# EAGLE design AnlgInp (EAGLE 5.11)
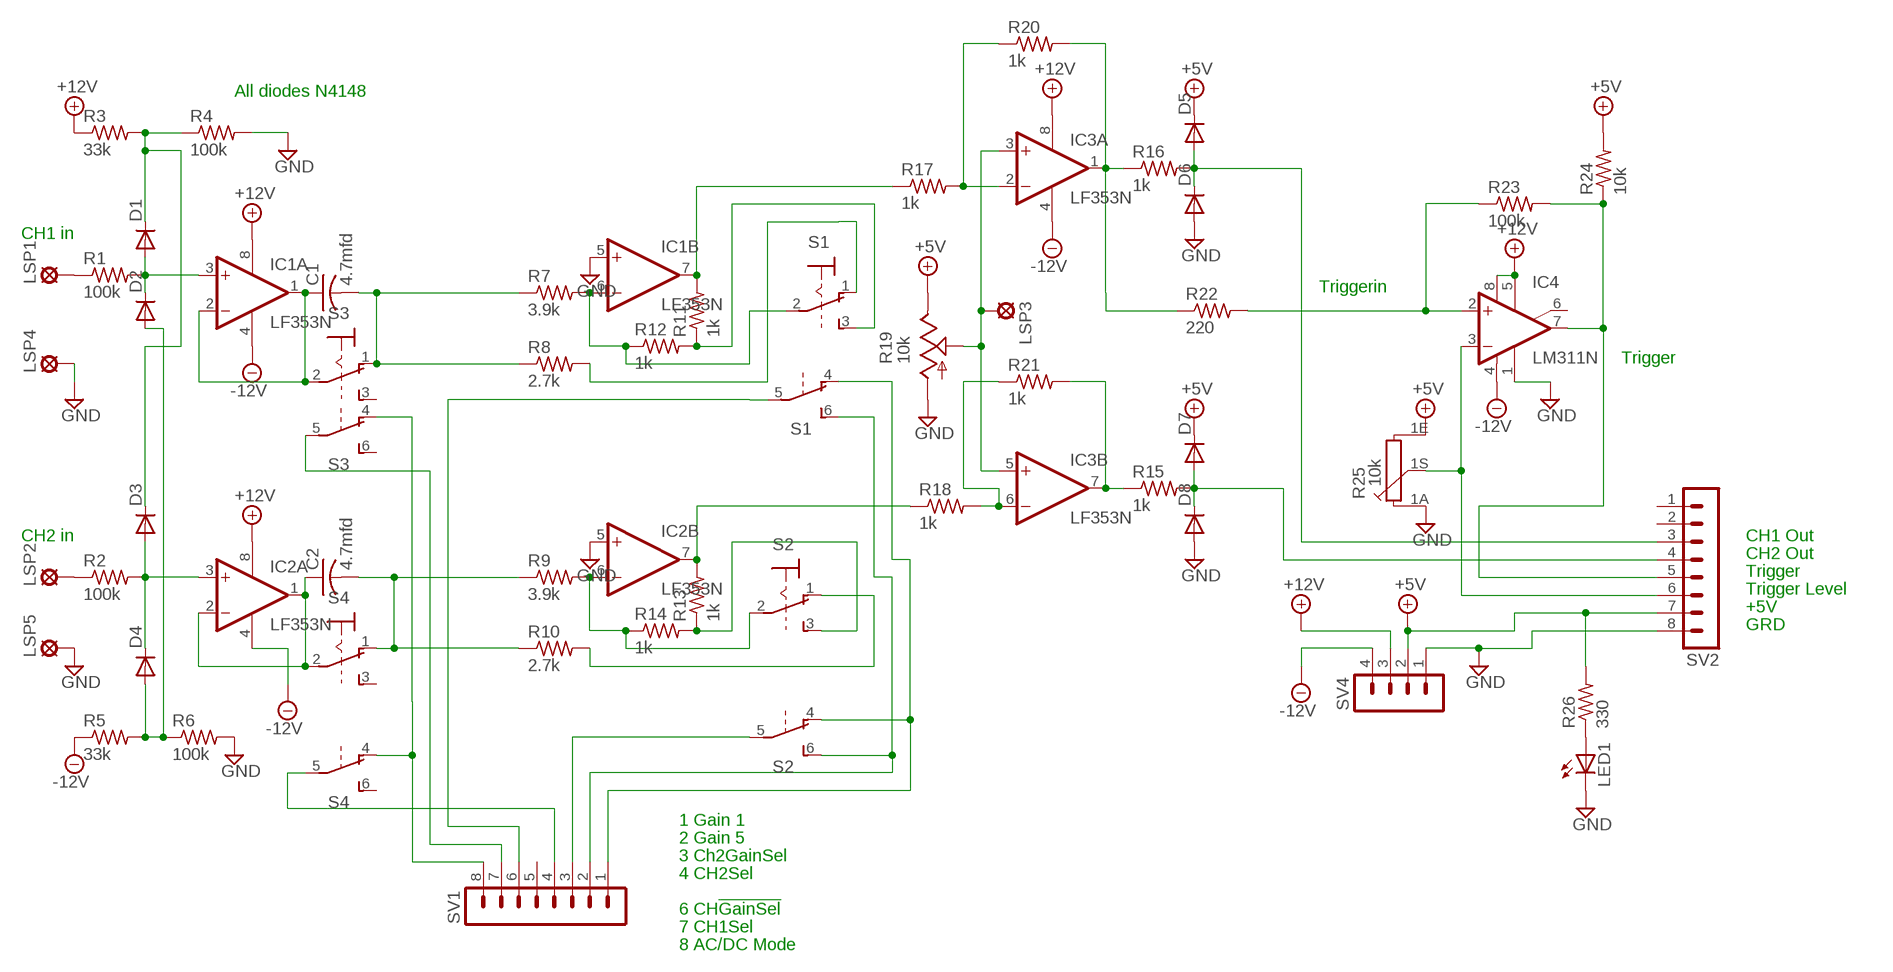
[diagram p0: schematic, sheet 1]

## Parts
C1  4.7mfd  C-US025-025X050  [C025-025X050]
C2  4.7mfd  C-US025-025X050  [C025-025X050]
D1  1N4148DO35-7  [DO35-7]
D2  1N4148DO35-7  [DO35-7]
D3  1N4148DO35-7  [DO35-7]
D4  1N4148DO35-7  [DO35-7]
D5  1N4148DO35-7  [DO35-7]
D6  1N4148DO35-7  [DO35-7]
D7  1N4148DO35-7  [DO35-7]
D8  1N4148DO35-7  [DO35-7]
IC1  LF353N  [DIL08]
IC2  LF353N  [DIL08]
IC3  LF353N  [DIL08]
IC4  LM311N  [DIL08]
LED1  LED3MM  [LED3MM]
LSP1  LSP11  [LSP11]
LSP2  LSP11  [LSP11]
LSP3  LSP11  [LSP11]
LSP4  LSP11  [LSP11]
LSP5  LSP11  [LSP11]
R1  100k  R-US_0204/7  [0204/7]
R2  100k  R-US_0204/7  [0204/7]
R3  33k  R-US_0204/7  [0204/7]
R4  100k  R-US_0204/7  [0204/7]
R5  33k  R-US_0204/7  [0204/7]
R6  100k  R-US_0204/7  [0204/7]
R7  3.9k  R-US_0204/7  [0204/7]
R8  2.7k  R-US_0204/7  [0204/7]
R9  3.9k  R-US_0204/7  [0204/7]
R10  2.7k  R-US_0204/7  [0204/7]
R11  1k  R-US_0204/7  [0204/7]
R12  1k  R-US_0204/7  [0204/7]
R13  1k  R-US_0204/7  [0204/7]
R14  1k  R-US_0204/7  [0204/7]
R15  1k  R-US_0204/7  [0204/7]
R16  1k  R-US_0204/7  [0204/7]
R17  1k  R-US_0204/7  [0204/7]
R18  1k  R-US_0204/7  [0204/7]
R19  10k  TRIM_US-B25P  [B25P]
R20  1k  R-US_0204/7  [0204/7]
R21  1k  R-US_0204/7  [0204/7]
R22  220  R-US_0204/7  [0204/7]
R23  100k  R-US_0204/7  [0204/7]
R24  10k  R-US_0204/7  [0204/7]
R25  10k  PC16S  [PC16S]
R26  330  R-US_0204/7  [0204/7]
S1  320-938  [320-938]
S2  320-938  [320-938]
S3  320-938  [320-938]
S4  320-938  [320-938]
SV1  MA08-1  [MA08-1]
SV2  MA08-1  [MA08-1]
SV4  MA04-1  [MA04-1]

## Nets
+5V: D5.C D7.C R19.E R24.2 R25.1E R26.2 SV2.7 SV4.2
+12V: IC1.8(P:V+) IC2.8(P:V+) IC3.8(P:V+) IC4.5(ON) IC4.8(V+) R3.1 SV4.3
-12V: IC1.4(P:V-) IC2.4(P:V-) IC3.4(P:V-) IC4.4(V-) R5.1 SV4.4
GND: D6.A D8.A IC1.5(B:+IN) IC2.5(B:+IN) IC4.1(GND) LED1.K(C) LSP4.MP LSP5.MP R4.2 R6.2 R19.A R25.1A SV2.8 SV4.1
N$1: D1.A D2.C IC1.3(A:+IN) R1.2
N$2: D1.C D3.C R3.2 R4.1
N$3: D2.A D4.A R5.2 R6.1
N$4: D3.A D4.C IC2.3(A:+IN) R2.2
N$5: S1.5(B:P) SV1.6
N$6: LSP1.MP R1.1
N$7: LSP2.MP R2.1
N$8: C1.1 IC1.1(A:OUT) IC1.2(A:-IN) S3.2(1:P)
N$9: C2.1 IC2.1(A:OUT) IC2.2(A:-IN) S4.2(1:P)
N$10: S3.4(B:O) S4.4(B:O) SV1.8
N$11: C1.2 R7.1 R8.1 S3.1(1:O)
N$12: C2.2 R9.1 R10.1 S4.1(1:O)
N$13: IC1.6(B:-IN) R7.2 R12.1 S1.2(1:P)
N$14: IC2.6(B:-IN) R9.2 R14.1 S2.2(1:P)
N$15: IC1.7(B:OUT) R11.2 R17.1
N$16: IC2.7(B:OUT) R13.2 R18.1
N$17: R11.1 R12.2 S1.3(1:S)
N$19: S4.5(B:P) SV1.4
N$20: R10.2 S2.1(1:O)
N$21: IC3.3(A:+IN) IC3.5(B:+IN) LSP3.MP R19.S
N$22: IC3.2(A:-IN) R17.2 R20.1
N$23: IC3.1(A:OUT) R16.1 R20.2 R22.1
N$24: IC3.7(B:OUT) R15.1 R21.2
N$25: IC3.6(B:-IN) R18.2 R21.1
N$26: LED1.A R26.1
N$27: S2.5(B:P) SV1.3
N$29: IC4.2(+IN) R22.2 R23.1
N$30: IC4.3(-IN) R25.1S SV2.6
N$31: IC4.7(OUT) R23.2 R24.1 SV2.5
N$32: S3.5(B:P) SV1.7
N$33: R8.2 S1.1(1:O)
N$34: R13.1 R14.2 S2.3(1:S)
N$35: S1.4(B:O) S2.4(B:O) SV1.1
N$36: S1.6(B:S) S2.6(B:S) SV1.2
N$39: D7.A D8.C R15.2 SV2.4
N$49: D5.A D6.C R16.2 SV2.3
Unconnected: IC4.6(ON/STR) S3.3(1:S) S3.6(B:S) S4.3(1:S) S4.6(B:S) SV1.5 SV2.1 SV2.2

## Notes on the sheet
- All diodes N4148
- CH1 in
- Triggerin
- Trigger
- CH2 in | CH1 Out
- CH2 Out
- Trigger
- Trigger Level
- +5V
- GRD
- 1 Gain 1
- 2 Gain 5
- 3 Ch2GainSel
- 4 CH2Sel
- 6 CH!GainSel
- 7 CH1Sel
- 8 AC/DC Mode

## Library data of the parts
C1 C2 = resistor:C-US: CAPACITOR, American symbol
D1-D8 = diode:1N4148: DIODE high speed (Philips)
IC1-IC3 = linear:LF353: OP AMP
IC4 = linear:LM311: COMPARATOR
LED1 = led:LED: LED OSRAM: - CHIPLED LG R971, LG N971, LY N971, LG Q971, LY Q971, LO R971, LY R971 LH N974, LH R974 LS Q976, LO Q976, LY Q976 LO Q996 - Hyper CHIPLED LW Q18S LB Q993, LB Q99A, LB R99A - SideLED LS A670, LO A670, LY A670, LG A670, LP A670 LB A673, LV A673, LT A673, LW A673 LH A674 LY A675 LS A676, LA A676, LO A676, LY A676, LW A676 LS A679, LY A679, LG A679 - Hyper Micro SIDELED® LS Y876, LA Y876, LO Y876, LY Y876 LT Y87S - SmartLED LW L88C, LW L88S LB L89C, LB L89S, LG L890 LS L89K, LO L89K, LY L89K LS L896, LA L896, LO L896, LY L896 - TOPLED LS T670, LO T670, LY T670, LG T670, LP T670 LSG T670, LSP T670, LSY T670, LOP T670, LYG T670 LG T671, LOG T671, LSG T671 LB T673, LV T673, LT T673, LW T673 LH T674 LS T676, LA T676, LO T676, LY T676, LB T676, LH T676, LSB T676, LW T676 LB T67C, LV T67C, LT T67C, LS T67K, LO T67K, LY T67K, LW E67C LS E67B, LA E67B, LO E67B, LY E67B, LB E67C, LV E67C, LT E67C LW T67C LS T679, LY T679, LG T679 LS T770, LO T770, LY T770, LG T770, LP T770 LB T773, LV T773, LT T773, LW T773 LH T774 LS E675, LA E675, LY E675, LS T675 LS T776, LA T776, LO T776, LY T776, LB T776 LHGB T686 LT T68C, LB T68C - Hyper Mini TOPLED® LB M676 - Mini TOPLED Santana® LG M470 LS M47K, LO M47K, LY M47K Source: http://www.osram.convergy.de LUXEON: - LUMILED® LXK2-PW12-R00, LXK2-PW12-S00, LXK2-PW14-U00, LXK2-PW14-V00 LXK2-PM12-R00, LXK2-PM12-S00, LXK2-PM14-U00 LXK2-PE12-Q00, LXK2-PE12-R00, LXK2-PE12-S00, LXK2-PE14-T00, LXK2-PE14-U00 LXK2-PB12-K00, LXK2-PB12-L00, LXK2-PB12-M00, LXK2-PB14-N00, LXK2-PB14-P00, LXK2-PB14-Q00 LXK2-PR12-L00, LXK2-PR12-M00, LXK2-PR14-Q00, LXK2-PR14-R00 LXK2-PD12-Q00, LXK2-PD12-R00, LXK2-PD12-S00 LXK2-PH12-R00, LXK2-PH12-S00 LXK2-PL12-P00, LXK2-PL12-Q00, LXK2-PL12-R00 Source: www.luxeon.com KINGBRIGHT: KA-3528ASYC Source: www.kingbright.com
LSP1-LSP5 = solpad:LSP11: SOLDER PAD drill 1.1 mm
R1-R6 = resistor:R-US_: RESISTOR, American symbol
R7-R18 R20-R24 R26 = rcl:R-US_: RESISTOR, American symbol
R19 = pot:TRIM_US-: POTENTIOMETER
R25 = piher:PC16S: POTENTIOMETER single carbon potentiometer, 16 mm, S3ROH; OC_FARNELL: 4452940; OC_NEWARK: unknown
S1-S4 = switch:320-938: TOGGLE SWITCH distributor RS Components
SV1 SV2 = con-lstb:MA08-1: PIN HEADER; OC_FARNELL: unknown; OC_NEWARK: unknown
SV4 = con-lstb:MA04-1: PIN HEADER; OC_FARNELL: unknown; OC_NEWARK: unknown

## Board
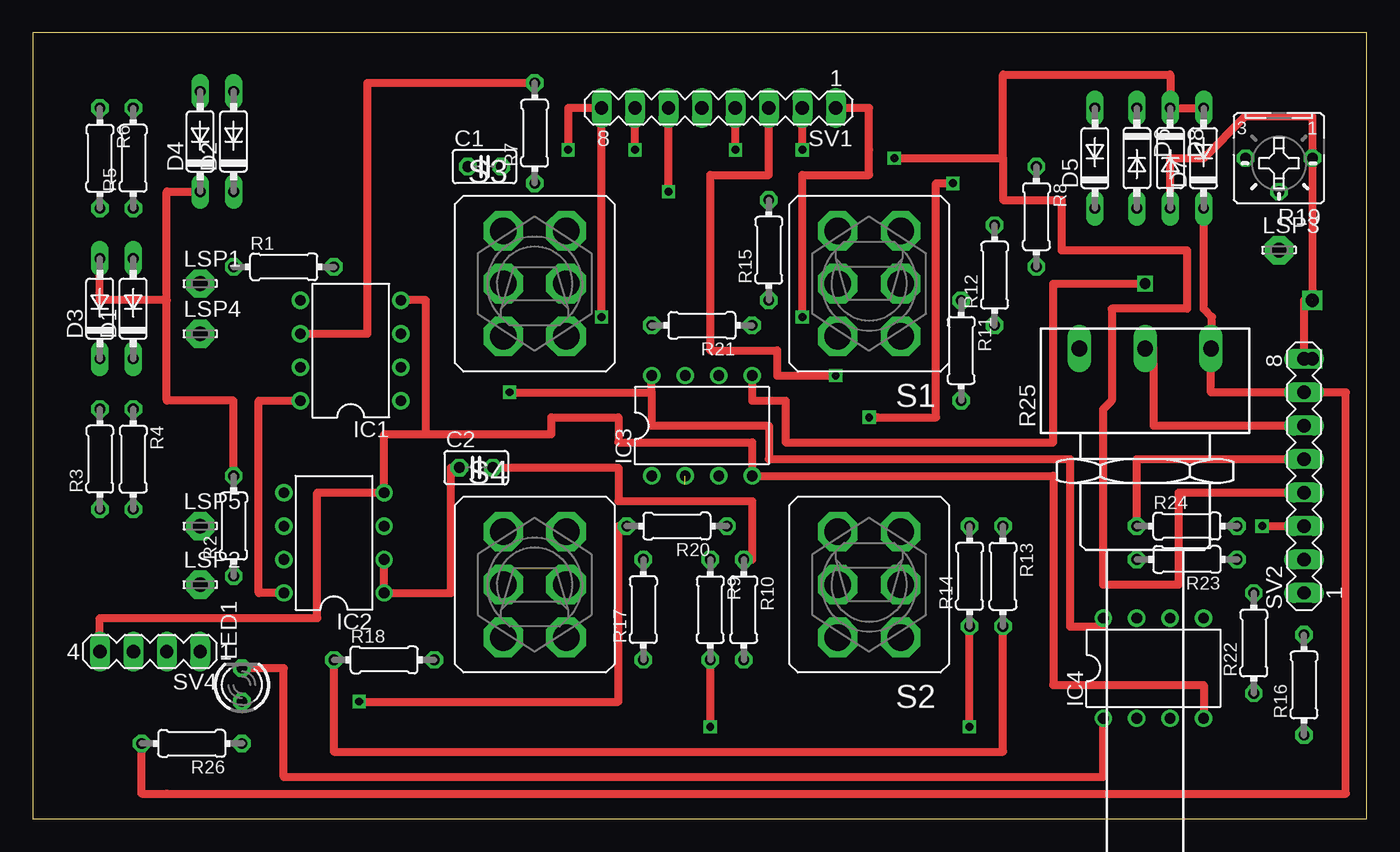
[diagram p1: board, top side]
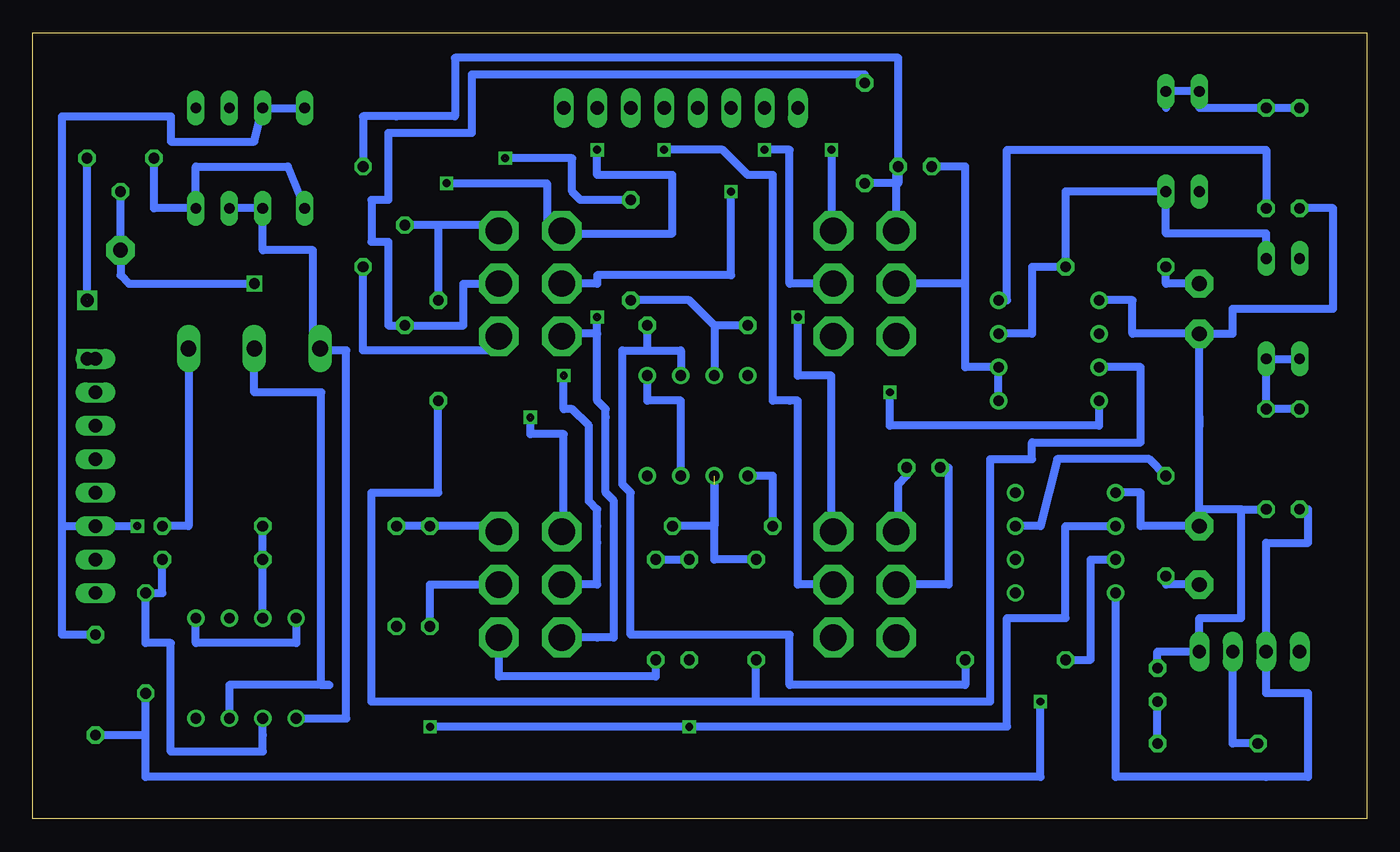
[diagram p2: board, bottom side, seen from below]

Size 101.27 x 59.68 mm. Coordinates in mm from the lower left corner, seen from the top.
Outline: 0,0 101.27,0 101.27,59.68 0,59.68 0,0
Copper layers (1*16): Top 0.035mm / dielectric 1.5mm / Bottom 0.035mm
Design rules "025mill": minimum track width 10mil, minimum drill 24mil, track to track 25mil, track to pad 25mil, pad to pad 25mil, via to via 25mil, smd to smd 25mil, copper to edge 25mil, drill to drill 8mil, minimum pad ring 10mil, minimum via ring 8mil, stop-mask expansion 4mil, vias tented up to drill 0mil, thermal gap 10mil

### Footprints (pad centres in the part's own frame; a part is rotated, then mirrored left to right if it is on the bottom)
C025-025X050 = drill 0.813 octagon: 1 -1.27,0; 2 1.27,0
DO35-7 = drill 0.813 long: A 3.81,0; C -3.81,0
DIL08 = drill 0.813 pad 1.27 round: 1 -3.81,-3.81; 2 -1.27,-3.81; 3 1.27,-3.81; 4 3.81,-3.81; 5 3.81,3.81; 6 1.27,3.81; 7 -1.27,3.81; 8 -3.81,3.81
LED3MM = drill 0.813 octagon: A -1.27,0; K 1.27,0
LSP11 = drill 1.118 pad 2.159 octagon: MP 0,0
0204/7 = drill 0.813 octagon: 1 -3.81,0; 2 3.81,0
B25P = drill 0.813 octagon: A -2.54,0; E 2.54,0; S 0,2.54
PC16S = drill 1.2 long: 1A -5,6.5; 1E 5,6.5; 1S 0,6.5
320-938 = drill 2.007 octagon: 1 -2.388,4.013; 2 -2.388,0; 3 -2.388,-4.013; 4 2.388,4.013; 5 2.388,0; 6 2.388,-4.013
MA08-1 = drill 1.016 long: 1 -8.89,0; 2 -6.35,0; 3 -3.81,0; 4 -1.27,0; 5 1.27,0; 6 3.81,0; 7 6.35,0; 8 8.89,0
MA04-1 = drill 1.016 long: 1 -3.81,0; 2 -1.27,0; 3 1.27,0; 4 3.81,0

### Placement (x,y rotation side)
C1  34.29,49.53 0 top
C2  33.66,26.67 0 top
D1  7.62,38.73 90 top
D2  15.24,51.44 90 top
D3  5.08,38.73 90 top
D4  12.7,51.44 90 top
D5  80.64,50.16 90 top
D6  83.82,50.16 270 top
D7  88.9,50.16 90 top
D8  86.36,50.16 270 top
IC1  24.13,35.56 90 top
IC2  22.86,20.95 90 top
IC3  50.8,29.84 0 top
IC4  85.09,11.43 0 top
LED1  15.88,10.16 90 top
LSP1  12.7,40.64 0 top
LSP2  12.7,17.78 0 top
LSP3  94.61,43.18 0 top
LSP4  12.7,36.83 0 top
LSP5  12.7,22.23 0 top
R1  19.05,41.91 0 top
R2  15.24,22.23 90 top
R3  5.08,27.3 90 top
R4  7.62,27.3 270 top
R5  7.62,50.16 90 top
R6  5.08,50.16 270 top
R7  38.1,52.07 90 top
R8  76.2,45.72 270 top
R9  51.44,15.88 270 top
R10  53.98,15.88 270 top
R11  70.48,35.56 270 top
R12  73.03,41.27 90 top
R13  73.66,18.41 270 top
R14  71.12,18.41 90 top
R15  55.88,43.18 90 top
R16  96.52,10.16 90 top
R17  46.35,15.88 90 top
R18  26.67,12.06 0 top
R19  94.61,50.16 180 top
R20  48.9,22.23 180 top
R21  50.8,37.47 180 top
R22  92.71,13.34 90 top
R23  87.63,19.68 180 top
R24  87.63,22.23 0 top
R25  84.45,29.21 0 top
R26  12.06,5.71 180 top
S1  63.5,40.64 180 top
S2  63.5,17.78 180 top
S3  38.1,40.64 0 top
S4  38.1,17.78 0 top
SV1  52.07,53.98 180 top
SV2  96.52,26.04 90 top
SV4  8.89,12.7 180 top

### Tracks (layer width: path | path; a pad name or v marks a point on that pad's centre or on a via)
+5V
  Top 0.61: R26.2 8.26,1.91 10.16,1.91 99.69,1.91 99.69,32.38 SV2.7 89.45,32.38 89.45,34.92 R25.1E 89.53,35.79 89.53,38.1 88.9,38.73 D7.C
  Bottom 0.61: R19.E 92.08,46.35 D7.C 88.9,49.53 81.92,49.53 D5.C | R24.2 89.45,22.23 R25.1E | SV4.2 10.16,5.71 R26.2
+12V  (via drill 0.6)
  Top 0.61: 46.99,32.38 46.99,29.84 55.88,29.84 55.88,27.3 78.74,27.3 78.74,14.61 81.28,14.61 IC4.8 | 46.99,32.38 IC3.8 | IC1.8 17.14,31.75 17.14,17.14 IC2.8 | v36.2,32.38 46.99,32.38
  Bottom 0.61: IC4.5 88.9,13.34 81.28,13.34 IC4.8 | IC2.8 19.05,3.17 7.62,3.17 4.45,3.17 4.45,9.53 7.62,9.53 SV4.3 7.62,20.95 4.45,20.95 4.45,23.5 R3.1 | IC1.8 20.32,29.84 36.2,29.84 v36.2,32.38
-12V
  Top 0.61: 29.84,29.21 28.57,29.21 26.67,29.21 IC2.4 21.59,24.77 21.59,15.24 5.08,15.24 SV4.4 | 29.84,29.21 39.37,29.21 39.37,30.48 44.45,30.48 44.45,28.57 54.61,28.57 | 54.61,28.57 IC3.4 | IC4.4 88.9,10.16 77.47,10.16 77.47,26.04 IC3.4 | IC1.4 29.84,39.37 29.84,29.21 | 54.61,28.57 IC3.4
  Bottom 0.61: IC1.4 27.3,39.37 27.3,50.8 7.62,50.8 R5.1
GND  (via drill 1)  (1 unrouted)
  Top 0.61: IC4.1 81.28,3.17 26.04,3.17 19.05,3.17 19.05,11.43 LED1.K | v97.16,34.92 SV2.8 96.52,39.37 97.16,39.37 97.16,45.72 97.16,53.34 92.08,53.34 88.9,50.16 86.36,50.16 D8.A
  Bottom 0.61: D8.A D6.A 83.82,43.18 80.01,43.18 80.01,35.71 R25.1A 79.45,35.56 77.47,35.56 77.47,7.62 IC4.1 | SV2.8 v97.16,34.92 | LSP4.MP 17.78,36.83 17.78,39.37 IC1.5 | 12.7,30.48 12.7,29.84 | 12.7,30.48 LSP4.MP | 12.7,22.86 LSP5.MP 17.14,22.23 17.14,24.77 IC2.5 | 12.7,22.86 12.7,30.48 | 9.53,23.5 R4.2 | 9.53,23.5 12.7,23.5 12.7,22.86 | LSP4.MP 10.16,36.83 10.16,38.73 2.54,38.73 2.54,46.35 R6.2 | 9.53,23.5 9.53,15.24 12.7,15.24 SV4.1 15.88,12.7 LED1.K | 97.16,39.37 R19.A
N$1
  Bottom 0.61: IC1.3 25.4,36.83 25.4,41.91 R1.2 22.86,47.62 D2.C 15.24,44.45 7.62,44.45 D1.A
N$2
  Bottom 0.61: D3.C D1.C R4.1 R3.2
N$3
  Bottom 0.61: R6.1 R5.2 12.7,53.98 D4.A D2.A | D2.A 15.24,53.98 D2.A
N$4
  Top 0.61: R2.2 15.24,31.75 10.16,31.75 10.16,39.37 | 10.16,39.37 5.08,39.37 D3.A | D4.C 10.16,47.62 10.16,39.37
  Bottom 0.61: IC2.3 24.77,22.23 23.5,27.3 16.51,27.3 R2.2
N$5  (via drill 0.6)
  Top 0.61: v48.26,47.62 SV1.6
  Bottom 0.61: S1.5 58.42,40.64 58.42,41.27 48.26,41.27 v48.26,47.62
N$6
  Bottom 0.61: LSP1.MP 15.24,40.64 R1.1
N$7
  Bottom 0.61: LSP2.MP 15.24,17.78 R2.1
N$8
  Bottom 0.61: 30.48,40.64 S3.2 30.48,40.64 | 30.48,40.64 30.48,34.29 IC1.2 IC1.1 | 30.48,40.64 30.48,49.53 C1.1
N$9
  Top 0.61: C2.1 31.75,26.67 31.75,17.14 IC2.1 IC2.2
  Bottom 0.61: C2.1 31.75,26.67 31.75,17.78 S4.2
N$10  (via drill 0.6)
  Top 0.61: v40.64,50.8 40.64,53.98 SV1.8 v43.18,38.1
  Bottom 0.61: S4.4 40.64,21.79 40.64,33.66 43.18,33.66 v43.18,38.1 | S3.4 40.64,44.65 v40.64,50.8
N$11
  Bottom 0.61: C1.2 35.71,48.9 S3.1 | C1.2 35.56,57.78 69.22,57.78 69.22,53.34 73.66,53.34 76.2,53.34 R8.1 | C1.2 35.56,48.26 R7.1
N$12
  Top 0.61: C2.2 42.55,26.67 44.45,26.67 44.45,24.13 53.98,24.13 54.61,24.13 54.61,19.68 R10.1
  Bottom 0.61: R10.1 R9.1 | C2.2 34.92,26.04 35.56,25.4 35.56,21.95 S4.1
N$13
  Top 0.61: R7.2 25.4,55.88 25.4,36.83 IC1.6
  Bottom 0.61: 74.3,40.64 74.3,43.18 74.3,43.81 75.56,43.81 75.56,46.99 74.3,46.99 74.3,48.9 74.3,52.07 67.94,52.07 67.94,56.52 38.1,56.52 R7.2 | 74.3,40.64 74.3,37.47 | 74.3,37.47 R12.1 | 74.3,37.47 R12.1 | 74.3,40.64 74.3,37.47 | 74.3,40.64 74.3,37.47 | 74.3,37.47 R12.1 | R12.1 68.58,37.47 68.58,40.64 S1.2
N$14  (via drill 0.6)
  Top 0.61: v71.12,6.99 R14.1 | v51.44,6.99 R9.2
  Bottom 0.61: S2.2 71.12,17.78 R14.1 | IC2.6 22.86,22.23 22.86,15.24 27.3,15.24 27.3,6.99 45.09,6.99 45.72,6.99 48.26,6.99 | 48.26,6.99 v51.44,6.99 | 48.26,6.99 v71.12,6.99
N$15
  Bottom 0.61: 28.57,12.7 28.57,11.43 28.57,8.89 46.35,8.89 | 28.57,12.7 28.57,13.34 | 46.35,8.89 R17.1 | R11.2 70.48,24.77 75.56,24.77 75.56,8.89 46.35,8.89 | 28.57,12.7 28.57,27.3 25.4,27.3 25.4,28.57 17.14,28.57 17.14,34.29 IC1.7
N$16
  Top 0.61: R18.1 22.86,5.08 73.66,5.08 R13.2
  Bottom 0.61: R18.1 20.95,12.06 20.95,19.68 IC2.7
N$17
  Bottom 0.61: 70.48,45.09 R11.1 | 70.48,45.09 R12.2 | 70.48,45.09 65.89,45.09 S1.3
N$18  (via drill 0.6 pad 1.02)
  other vias: 93.34,22.23
N$19  (via drill 0.6)
  Top 0.61: v53.34,50.8 SV1.4
  Bottom 0.61: S4.5 43.18,17.78 43.18,31.75 43.81,31.75 45.09,31.75 45.09,48.9 46.99,48.9 47.62,49.53 48.9,50.8 v53.34,50.8
N$20
  Bottom 0.61: R10.2 53.98,10.79 65.89,10.79 S2.1
N$21  (via drill 0.8)
  Top 0.61: IC3.5 54.61,31.75 57.15,31.75 57.15,28.57 77.47,28.57 77.47,33.66 77.47,39.37 77.47,40.64 v84.45,40.64
  Bottom 0.61: R19.S LSP3.MP 94.61,41.27 93.98,40.64 v84.45,40.64 | IC3.3 52.07,31.75 54.61,31.75 IC3.5
N$22  (1 unrouted)
  Bottom 0.61: R20.1 49.53,22.23 49.53,25.4 49.53,19.68 R17.2
N$23  (via drill 0.6)
  Top 0.61: v24.77,8.89 44.45,8.89 44.45,22.23 R20.2
  Bottom 0.61: IC3.1 45.09,26.04 R20.2 | 92.71,6.35 92.71,3.17 24.77,3.17 v24.77,8.89 | 92.71,6.35 R22.1 | 92.71,6.35 R16.1
N$24
  Bottom 0.61: 49.53,37.47 IC3.7 | R21.2 49.53,37.47 | R15.1 51.44,39.37 49.53,37.47
N$25
  Bottom 0.61: R18.2 30.48,10.16 43.81,10.16 43.81,13.97 55.88,13.97 55.88,24.77 56.52,25.4 56.52,31.75 56.52,35.56 54.61,35.56 | IC3.6 52.07,35.56 54.61,35.56 | 54.61,35.56 R21.1
N$26
  Bottom 0.61: R26.1 LED1.A
N$27  (1 unrouted)
  Top 0.61: SV1.3 55.88,50.8 55.88,48.9 51.44,48.9 51.44,35.56 56.52,35.56 56.52,33.66 60.96,33.66
  Bottom 0.61: S2.5 58.42,17.78 58.42,20.95 58.42,22.23 58.42,23.5 59.05,24.13 59.05,29.84 60.33,31.11 60.96,31.11 60.96,33.66
N$28  (via drill 0.6)
  other vias: 60.96,33.66
N$29
  Bottom 0.61: R23.1 91.44,17.14 R22.2 92.71,13.34 90.81,13.34 90.81,5.08 83.82,5.08 83.82,6.35 IC4.2
N$30
  Top 0.61: R25.1S 85.09,35.71 85.09,29.84 SV2.6 | SV2.6 97.16,29.84 SV2.6
  Bottom 0.61: IC4.3 86.36,10.16 78.74,10.16 79.38,10.16 79.38,32.38 84.45,32.38 R25.1S
N$31
  Top 0.61: SV2.5 83.82,27.3 R24.1
  Bottom 0.61: R24.1 R23.2 IC4.7
N$32  (via drill 0.6)
  Top 0.61: v45.72,50.8 SV1.7
  Bottom 0.61: S3.5 43.81,40.64 43.81,50.8 v45.72,50.8
N$33
  Bottom 0.61: S1.1 65.25,36.83 65.41,36.83 65.41,35.56 76.2,35.56 R8.2
N$34
  Bottom 0.61: R13.1 R14.2 65.89,22.23 S2.3
N$35  (1 unrouted)
  Top 0.61: SV1.1 63.5,53.98 63.5,50.8 63.5,48.9 58.42,48.9 58.42,38.1
  Bottom 0.61: 60.96,36.83 60.96,36.2 60.96,36.63 S1.4 61.11,36.83 58.42,36.83 | S2.4 58.42,13.77 57.15,13.77 57.15,22.23 57.15,23.5 57.15,24.13 57.78,24.77 57.78,30.48 57.78,31.11 58.42,31.75 58.42,36.83 | 58.42,36.83 58.42,38.1
N$36  (via drill 0.6)  (1 unrouted)
  Top 0.61: v69.85,48.26 68.58,48.26 68.58,30.48 64.14,30.48 63.5,30.48 | v58.42,50.8 SV1.2 v58.42,50.8
  Bottom 0.61: v58.42,50.8 58.42,48.9 52.7,48.9 52.7,44.45 60.91,44.45 S1.6 62.23,44.65 62.23,48.26 v69.85,48.26 | S2.6 60.96,21.79 60.96,29.21 63.5,29.21 63.5,30.48
N$37  (via drill 0.6)
  other vias: 65.41,50.16
N$38  (via drill 0.6)
  other vias: 24.77,8.89
N$39  (1 unrouted)
  Top 0.61: SV2.4 93.34,24.77 87,24.77 87,17.78 81.28,17.78 81.28,31.11 81.92,31.75 81.92,38.73 87.63,38.73 87.63,43.18 81.92,43.18 78.11,43.18 78.11,46.35 78.11,46.99 73.66,46.99 73.66,50.16 | D7.A D8.C 86.36,56.52 73.66,56.52 73.66,50.16 | 65.41,50.16 73.66,50.16
  Bottom 0.61: R15.2 59.05,46.99 59.69,46.99 60.33,47.62 60.33,50.16 65.41,50.16
N$40  (via drill 0.6)
  other vias: 63.5,30.48
N$41  (via drill 0.6)
  other vias: 69.85,48.26
N$42  (via drill 1)
  other vias: 97.16,39.37
N$44  (via drill 0.6)
  other vias: 58.42,38.1
N$49  (1 unrouted)
  Top 0.61: 93.34,22.23 SV2.3
  Bottom 0.61: D5.A D6.C 84.45,51.44 90.81,51.44 90.81,53.34 99.06,53.34 99.06,22.23 | 95.89,22.23 93.34,22.23 95.89,22.23 | 99.06,22.23 95.89,22.23 | R16.2 99.06,13.97 99.06,22.23